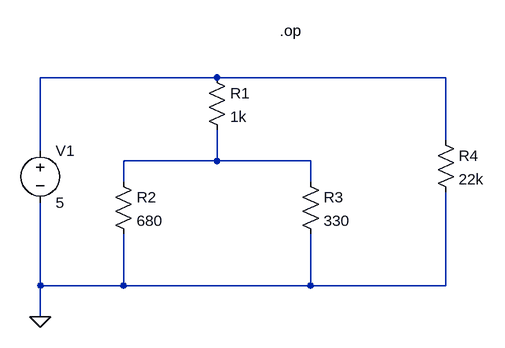
[diagram p0: schematic Ej 1.asc]
Ej 1.asc, the LTspice schematic file:
Version 4
SHEET 1 880 680
WIRE 368 160 96 160
WIRE 720 160 368 160
WIRE 720 256 720 160
WIRE 96 272 96 160
WIRE 368 288 368 240
WIRE 368 288 224 288
WIRE 512 288 368 288
WIRE 224 320 224 288
WIRE 512 320 512 288
WIRE 96 480 96 352
WIRE 224 480 224 400
WIRE 224 480 96 480
WIRE 512 480 512 400
WIRE 512 480 224 480
WIRE 720 480 720 336
WIRE 720 480 512 480
WIRE 96 528 96 480
FLAG 96 528 0
SYMBOL res 352 144 R0
SYMATTR InstName R1
SYMATTR Value 1k
SYMBOL res 208 304 R0
SYMATTR InstName R2
SYMATTR Value 680
SYMBOL res 496 304 R0
SYMATTR InstName R3
SYMATTR Value 330
SYMBOL res 704 240 R0
SYMATTR InstName R4
SYMATTR Value 22k
SYMBOL voltage 96 256 R0
SYMATTR InstName V1
SYMATTR Value 5
TEXT 464 88 Left 2 !.op

The netlist it stands for:
* Ej 1.asc
R1 N001 N002 1k
R2 N002 0 680
R3 N002 0 330
R4 N001 0 22k
V1 N001 0 5
.op
.backanno
.end